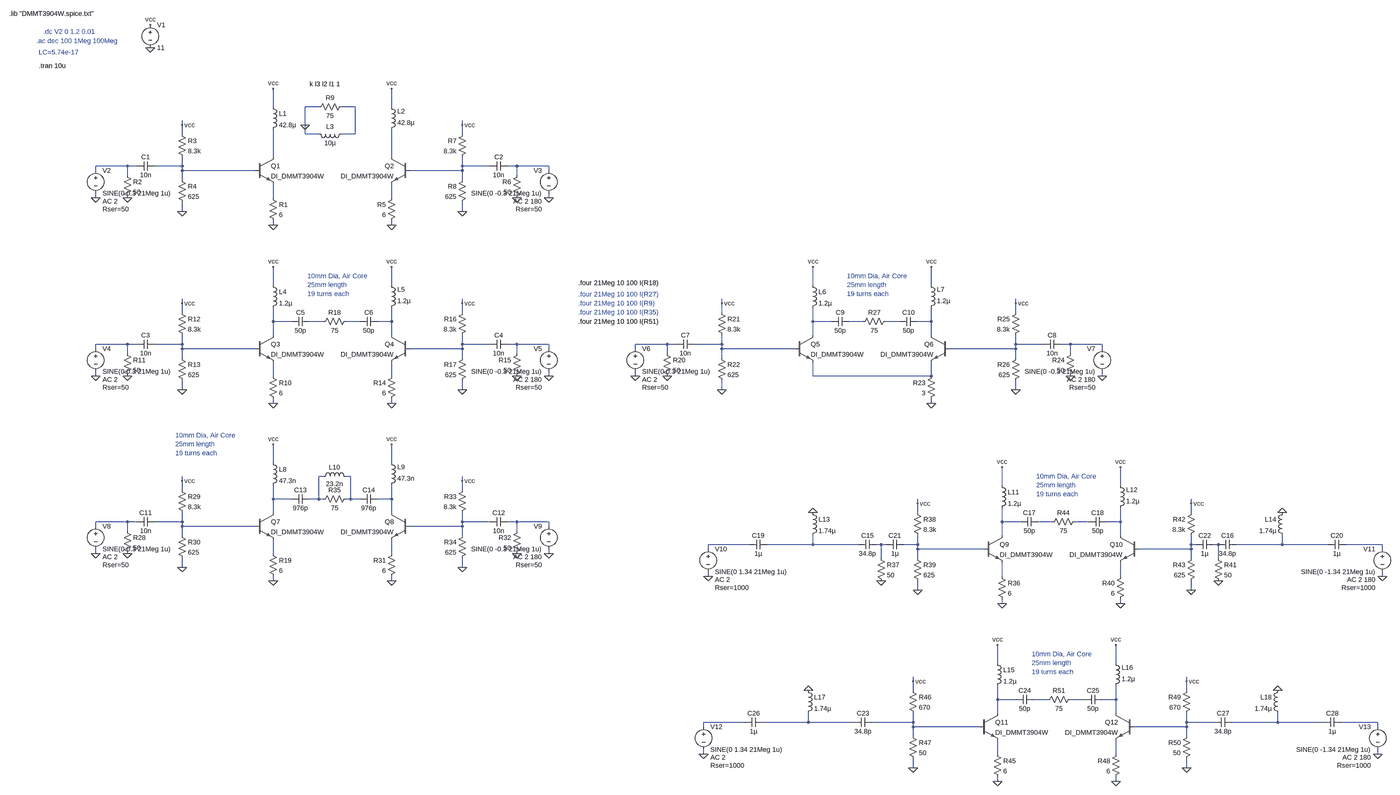
[diagram p0: schematic Class_AB.asc, whole sheet]
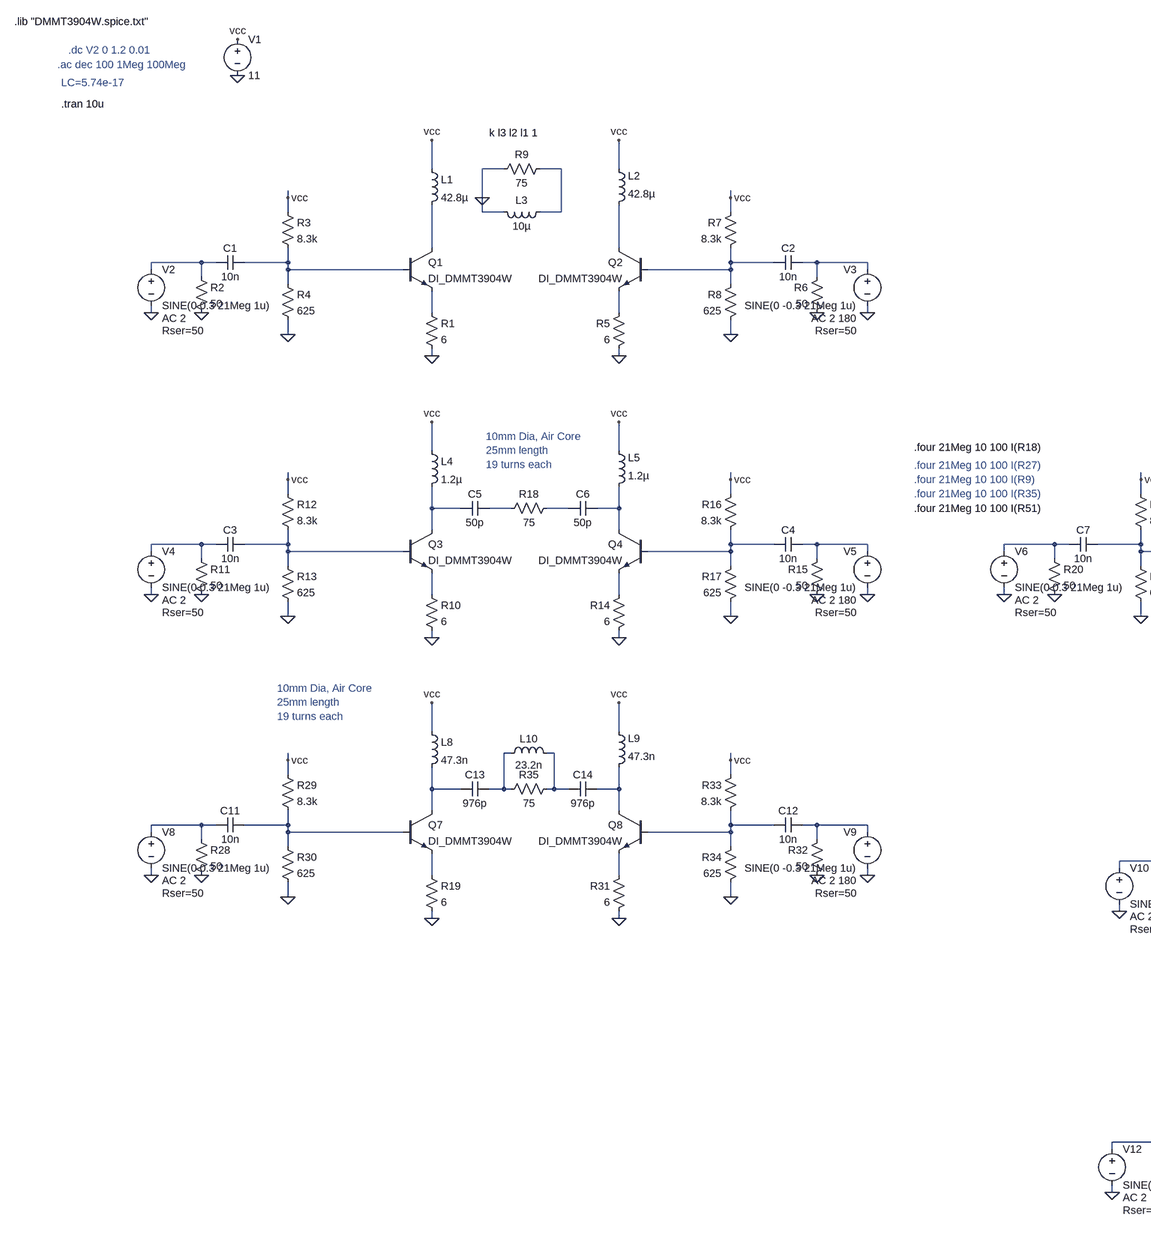
[diagram p1: schematic Class_AB.asc, part, row 1 of 1, column 1 of 2]
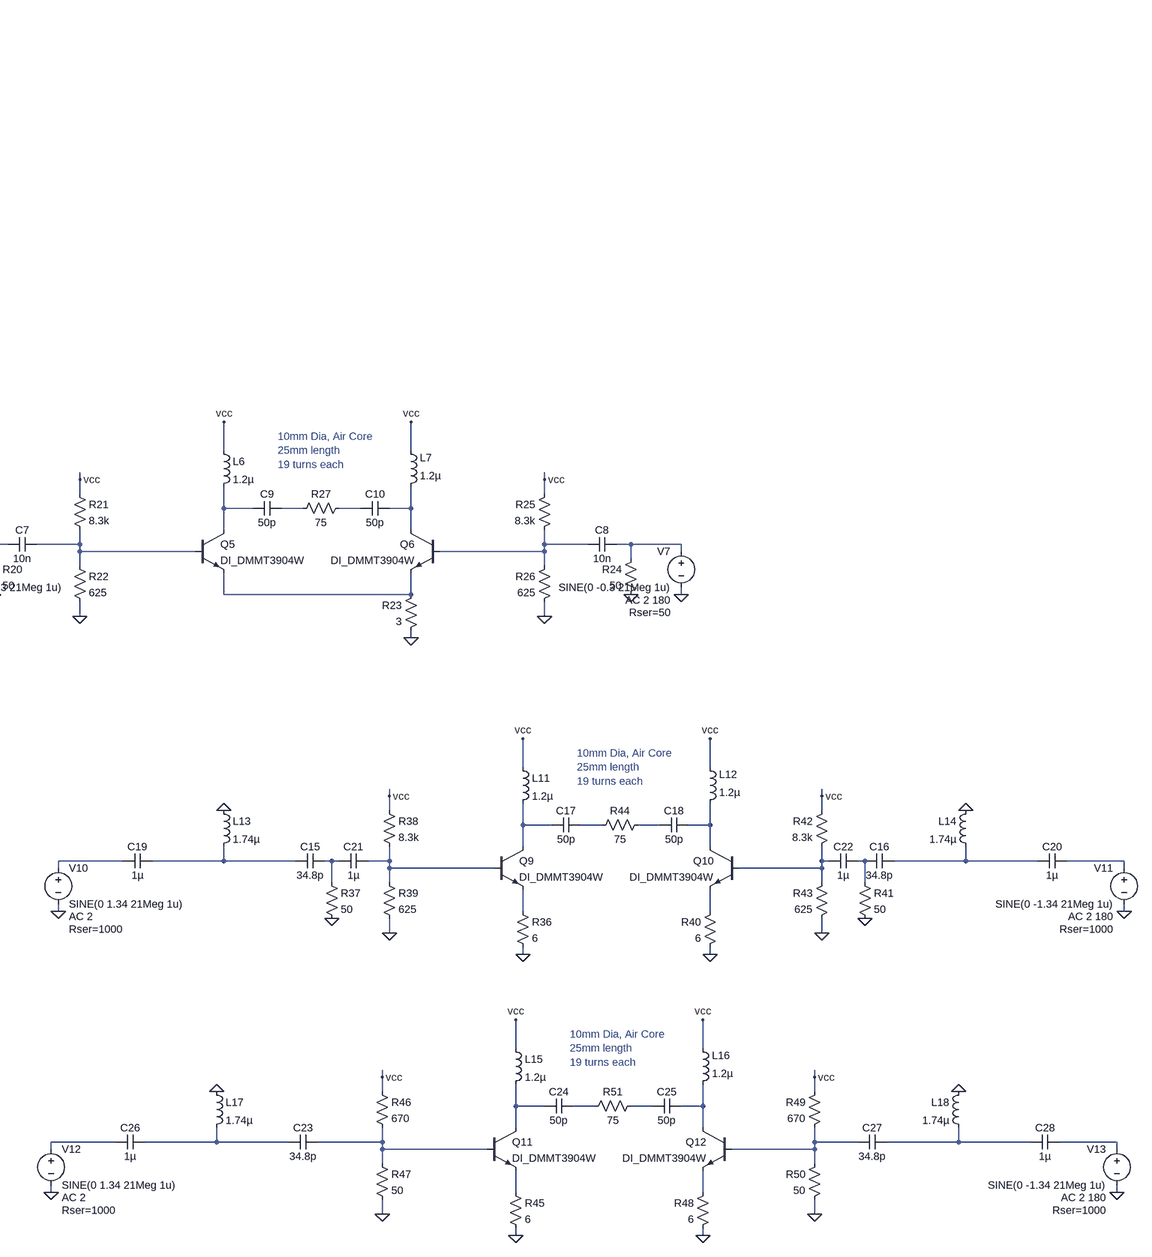
[diagram p2: schematic Class_AB.asc, part, row 1 of 1, column 2 of 2]
Class_AB.asc, the LTspice schematic file:
Version 4.1
SHEET 1 4292 2340
WIRE 192 -80 192 -144
WIRE 352 -80 304 -80
WIRE 480 -80 432 -80
WIRE 608 -80 608 -144
WIRE -128 -16 -128 -32
WIRE 304 -16 304 -80
WIRE 928 -16 928 -32
WIRE -128 16 -128 -16
WIRE 304 16 304 -16
WIRE 352 16 304 16
WIRE 480 16 480 -80
WIRE 480 16 432 16
WIRE 928 16 928 -16
WIRE 192 96 192 0
WIRE 608 96 608 0
WIRE -320 128 -432 128
WIRE -288 128 -320 128
WIRE -128 128 -128 96
WIRE -128 128 -224 128
WIRE 928 128 928 96
WIRE 1024 128 928 128
WIRE 1120 128 1088 128
WIRE 1232 128 1120 128
WIRE -432 144 -432 128
WIRE -128 144 -128 128
WIRE 128 144 -128 144
WIRE 928 144 928 128
WIRE 928 144 672 144
WIRE 1232 144 1232 128
WIRE -320 160 -320 128
WIRE 1120 160 1120 128
WIRE -128 176 -128 144
WIRE 928 176 928 144
WIRE -432 240 -432 224
WIRE 192 240 192 192
WIRE 608 240 608 192
WIRE 1232 240 1232 224
WIRE -128 288 -128 256
WIRE 928 288 928 256
WIRE 192 336 192 320
WIRE 608 336 608 320
WIRE 192 560 192 496
WIRE 608 560 608 496
WIRE 2160 560 2160 496
WIRE 2576 560 2576 496
WIRE -128 624 -128 608
WIRE 928 624 928 608
WIRE 1840 624 1840 608
WIRE 2896 624 2896 608
WIRE -128 656 -128 624
WIRE 928 656 928 624
WIRE 1840 656 1840 624
WIRE 2896 656 2896 624
WIRE 192 688 192 640
WIRE 256 688 192 688
WIRE 368 688 320 688
WIRE 496 688 448 688
WIRE 608 688 608 640
WIRE 608 688 560 688
WIRE 2160 688 2160 640
WIRE 2224 688 2160 688
WIRE 2336 688 2288 688
WIRE 2464 688 2416 688
WIRE 2576 688 2576 640
WIRE 2576 688 2528 688
WIRE 192 736 192 688
WIRE 608 736 608 688
WIRE 2160 736 2160 688
WIRE 2576 736 2576 688
WIRE -320 768 -432 768
WIRE -288 768 -320 768
WIRE -128 768 -128 736
WIRE -128 768 -224 768
WIRE 928 768 928 736
WIRE 1024 768 928 768
WIRE 1120 768 1088 768
WIRE 1232 768 1120 768
WIRE 1648 768 1536 768
WIRE 1680 768 1648 768
WIRE 1840 768 1840 736
WIRE 1840 768 1744 768
WIRE 2896 768 2896 736
WIRE 2992 768 2896 768
WIRE 3088 768 3056 768
WIRE 3200 768 3088 768
WIRE -432 784 -432 768
WIRE -128 784 -128 768
WIRE 128 784 -128 784
WIRE 928 784 928 768
WIRE 928 784 672 784
WIRE 1232 784 1232 768
WIRE 1536 784 1536 768
WIRE 1840 784 1840 768
WIRE 2096 784 1840 784
WIRE 2896 784 2896 768
WIRE 2896 784 2640 784
WIRE 3200 784 3200 768
WIRE -320 800 -320 768
WIRE 1120 800 1120 768
WIRE 1648 800 1648 768
WIRE 3088 800 3088 768
WIRE -128 816 -128 784
WIRE 928 816 928 784
WIRE 1840 816 1840 784
WIRE 2896 816 2896 784
WIRE -432 880 -432 864
WIRE 192 880 192 832
WIRE 608 880 608 832
WIRE 1232 880 1232 864
WIRE 1536 880 1536 864
WIRE 2160 880 2160 832
WIRE 2576 880 2576 832
WIRE 2576 880 2160 880
WIRE 3200 880 3200 864
WIRE -128 928 -128 896
WIRE 928 928 928 896
WIRE 1840 928 1840 896
WIRE 2896 928 2896 896
WIRE 192 976 192 960
WIRE 608 976 608 960
WIRE 2576 976 2576 960
WIRE 192 1184 192 1120
WIRE 608 1184 608 1120
WIRE 368 1232 352 1232
WIRE 464 1232 448 1232
WIRE -128 1248 -128 1232
WIRE 928 1248 928 1232
WIRE 2848 1264 2848 1200
WIRE 3264 1264 3264 1200
WIRE -128 1280 -128 1248
WIRE 928 1280 928 1248
WIRE 192 1312 192 1264
WIRE 256 1312 192 1312
WIRE 352 1312 352 1232
WIRE 352 1312 320 1312
WIRE 368 1312 352 1312
WIRE 464 1312 464 1232
WIRE 464 1312 448 1312
WIRE 496 1312 464 1312
WIRE 608 1312 608 1264
WIRE 608 1312 560 1312
WIRE 2528 1328 2528 1312
WIRE 3584 1328 3584 1312
WIRE 192 1360 192 1312
WIRE 608 1360 608 1312
WIRE 2528 1360 2528 1328
WIRE 3584 1360 3584 1328
WIRE -320 1392 -432 1392
WIRE -288 1392 -320 1392
WIRE -128 1392 -128 1360
WIRE -128 1392 -224 1392
WIRE 928 1392 928 1360
WIRE 1024 1392 928 1392
WIRE 1120 1392 1088 1392
WIRE 1232 1392 1120 1392
WIRE 2848 1392 2848 1344
WIRE 2912 1392 2848 1392
WIRE 3024 1392 2976 1392
WIRE 3152 1392 3104 1392
WIRE 3264 1392 3264 1344
WIRE 3264 1392 3216 1392
WIRE -432 1408 -432 1392
WIRE -128 1408 -128 1392
WIRE 128 1408 -128 1408
WIRE 928 1408 928 1392
WIRE 928 1408 672 1408
WIRE 1232 1408 1232 1392
WIRE -320 1424 -320 1392
WIRE 1120 1424 1120 1392
WIRE -128 1440 -128 1408
WIRE 928 1440 928 1408
WIRE 2848 1440 2848 1392
WIRE 3264 1440 3264 1392
WIRE 1936 1472 1792 1472
WIRE 2160 1472 2160 1440
WIRE 2160 1472 2000 1472
WIRE 2320 1472 2160 1472
WIRE 2400 1472 2384 1472
WIRE 2416 1472 2400 1472
WIRE 2528 1472 2528 1440
WIRE 2528 1472 2480 1472
WIRE 3584 1472 3584 1440
WIRE 3600 1472 3584 1472
WIRE 3680 1472 3664 1472
WIRE 3904 1472 3904 1440
WIRE 3904 1472 3744 1472
WIRE 4064 1472 3904 1472
WIRE 4256 1472 4128 1472
WIRE 1792 1488 1792 1472
WIRE 2528 1488 2528 1472
WIRE 2784 1488 2528 1488
WIRE 3584 1488 3584 1472
WIRE 3584 1488 3328 1488
WIRE 4256 1488 4256 1472
WIRE -432 1504 -432 1488
WIRE 192 1504 192 1456
WIRE 608 1504 608 1456
WIRE 1232 1504 1232 1488
WIRE 2400 1520 2400 1472
WIRE 2528 1520 2528 1488
WIRE 3584 1520 3584 1488
WIRE 3680 1520 3680 1472
WIRE -128 1552 -128 1520
WIRE 928 1552 928 1520
WIRE 1792 1584 1792 1568
WIRE 2848 1584 2848 1536
WIRE 3264 1584 3264 1536
WIRE 4256 1584 4256 1568
WIRE 192 1600 192 1584
WIRE 608 1600 608 1584
WIRE 2528 1632 2528 1600
WIRE 3584 1632 3584 1600
WIRE 2848 1680 2848 1664
WIRE 3264 1680 3264 1664
WIRE 2832 1904 2832 1840
WIRE 3248 1904 3248 1840
WIRE 2512 1968 2512 1952
WIRE 3568 1968 3568 1952
WIRE 2512 2000 2512 1968
WIRE 3568 2000 3568 1968
WIRE 2832 2032 2832 1984
WIRE 2896 2032 2832 2032
WIRE 3008 2032 2960 2032
WIRE 3136 2032 3088 2032
WIRE 3248 2032 3248 1984
WIRE 3248 2032 3200 2032
WIRE 2832 2080 2832 2032
WIRE 3248 2080 3248 2032
WIRE 1920 2112 1776 2112
WIRE 2144 2112 2144 2080
WIRE 2144 2112 1984 2112
WIRE 2304 2112 2144 2112
WIRE 2512 2112 2512 2080
WIRE 2512 2112 2368 2112
WIRE 3568 2112 3568 2080
WIRE 3664 2112 3568 2112
WIRE 3888 2112 3888 2080
WIRE 3888 2112 3728 2112
WIRE 4048 2112 3888 2112
WIRE 4240 2112 4112 2112
WIRE 1776 2128 1776 2112
WIRE 2512 2128 2512 2112
WIRE 2768 2128 2512 2128
WIRE 3568 2128 3568 2112
WIRE 3568 2128 3312 2128
WIRE 4240 2128 4240 2112
WIRE 2512 2160 2512 2128
WIRE 3568 2160 3568 2128
WIRE 1776 2224 1776 2208
WIRE 2832 2224 2832 2176
WIRE 3248 2224 3248 2176
WIRE 4240 2224 4240 2208
WIRE 2512 2272 2512 2240
WIRE 3568 2272 3568 2240
WIRE 2832 2320 2832 2304
WIRE 3248 2320 3248 2304
FLAG -240 -288 0
FLAG -432 240 0
FLAG 192 336 0
FLAG -240 -368 vcc
FLAG -320 240 0
FLAG -128 288 0
FLAG -128 -16 vcc
FLAG 192 -144 vcc
FLAG 1232 240 0
FLAG 608 336 0
FLAG 1120 240 0
FLAG 928 288 0
FLAG 928 -16 vcc
FLAG 608 -144 vcc
FLAG 304 -16 0
FLAG -432 880 0
FLAG 192 976 0
FLAG -320 880 0
FLAG -128 928 0
FLAG -128 624 vcc
FLAG 192 496 vcc
FLAG 1232 880 0
FLAG 608 976 0
FLAG 1120 880 0
FLAG 928 928 0
FLAG 928 624 vcc
FLAG 608 496 vcc
FLAG 1536 880 0
FLAG 1648 880 0
FLAG 1840 928 0
FLAG 1840 624 vcc
FLAG 2160 496 vcc
FLAG 3200 880 0
FLAG 2576 976 0
FLAG 3088 880 0
FLAG 2896 928 0
FLAG 2896 624 vcc
FLAG 2576 496 vcc
FLAG -432 1504 0
FLAG 192 1600 0
FLAG -320 1504 0
FLAG -128 1552 0
FLAG -128 1248 vcc
FLAG 192 1120 vcc
FLAG 1232 1504 0
FLAG 608 1600 0
FLAG 1120 1504 0
FLAG 928 1552 0
FLAG 928 1248 vcc
FLAG 608 1120 vcc
FLAG 1792 1584 0
FLAG 2848 1680 0
FLAG 2528 1632 0
FLAG 2528 1328 vcc
FLAG 2848 1200 vcc
FLAG 4256 1584 0
FLAG 3264 1680 0
FLAG 3584 1632 0
FLAG 3584 1328 vcc
FLAG 3264 1200 vcc
FLAG 2160 1360 0
FLAG 3904 1360 0
FLAG 3680 1600 0
FLAG 2400 1600 0
FLAG 1776 2224 0
FLAG 2832 2320 0
FLAG 2512 2272 0
FLAG 2512 1968 vcc
FLAG 2832 1840 vcc
FLAG 4240 2224 0
FLAG 3248 2320 0
FLAG 3568 2272 0
FLAG 3568 1968 vcc
FLAG 3248 1840 vcc
FLAG 2144 2000 0
FLAG 3888 2000 0
SYMBOL npn 128 96 R0
SYMATTR InstName Q1
SYMATTR Value DI_DMMT3904W
SYMBOL voltage -240 -384 R0
WINDOW 123 0 0 Left 0
WINDOW 39 0 0 Left 0
SYMATTR InstName V1
SYMATTR Value 11
SYMBOL voltage -432 128 R0
WINDOW 123 24 124 Left 2
WINDOW 39 24 152 Left 2
SYMATTR Value2 AC 2
SYMATTR SpiceLine Rser=50
SYMATTR InstName V2
SYMATTR Value SINE(0 0.3 21Meg 1u)
SYMBOL res 176 224 R0
SYMATTR InstName R1
SYMATTR Value 6
SYMBOL cap -224 112 R90
WINDOW 0 0 32 VBottom 2
WINDOW 3 32 32 VTop 2
SYMATTR InstName C1
SYMATTR Value 10n
SYMBOL res -336 144 R0
SYMATTR InstName R2
SYMATTR Value 50
SYMBOL res -144 0 R0
SYMATTR InstName R3
SYMATTR Value 8.3k
SYMBOL res -144 160 R0
SYMATTR InstName R4
SYMATTR Value 625
SYMBOL ind 176 -96 R0
SYMATTR InstName L1
SYMATTR Value 42.8µ
SYMATTR Type ind
SYMATTR SpiceLine Rser=1m
SYMBOL npn 672 96 M0
SYMATTR InstName Q2
SYMATTR Value DI_DMMT3904W
SYMBOL voltage 1232 128 M0
WINDOW 123 24 124 Left 2
WINDOW 39 24 152 Left 2
SYMATTR Value2 AC 2 180
SYMATTR SpiceLine Rser=50
SYMATTR InstName V3
SYMATTR Value SINE(0 -0.3 21Meg 1u)
SYMBOL res 624 224 M0
SYMATTR InstName R5
SYMATTR Value 6
SYMBOL cap 1024 112 M90
WINDOW 0 0 32 VBottom 2
WINDOW 3 32 32 VTop 2
SYMATTR InstName C2
SYMATTR Value 10n
SYMBOL res 1136 144 M0
SYMATTR InstName R6
SYMATTR Value 50
SYMBOL res 944 0 M0
SYMATTR InstName R7
SYMATTR Value 8.3k
SYMBOL res 944 160 M0
SYMATTR InstName R8
SYMATTR Value 625
SYMBOL ind 592 16 M180
WINDOW 0 36 80 Left 2
WINDOW 3 36 40 Left 2
SYMATTR InstName L2
SYMATTR Value 42.8µ
SYMATTR Type ind
SYMATTR SpiceLine Rser=1m
SYMBOL ind 448 0 R90
WINDOW 0 5 56 VBottom 2
WINDOW 3 32 56 VTop 2
SYMATTR InstName L3
SYMATTR Value 10µ
SYMATTR Type ind
SYMATTR SpiceLine Rser=1m
SYMBOL res 448 -96 R90
WINDOW 0 0 56 VBottom 2
WINDOW 3 32 56 VTop 2
SYMATTR InstName R9
SYMATTR Value 75
SYMBOL npn 128 736 R0
SYMATTR InstName Q3
SYMATTR Value DI_DMMT3904W
SYMBOL voltage -432 768 R0
WINDOW 123 24 124 Left 2
WINDOW 39 24 152 Left 2
SYMATTR Value2 AC 2
SYMATTR SpiceLine Rser=50
SYMATTR InstName V4
SYMATTR Value SINE(0 0.3 21Meg 1u)
SYMBOL res 176 864 R0
SYMATTR InstName R10
SYMATTR Value 6
SYMBOL cap -224 752 R90
WINDOW 0 0 32 VBottom 2
WINDOW 3 32 32 VTop 2
SYMATTR InstName C3
SYMATTR Value 10n
SYMBOL res -336 784 R0
SYMATTR InstName R11
SYMATTR Value 50
SYMBOL res -144 640 R0
SYMATTR InstName R12
SYMATTR Value 8.3k
SYMBOL res -144 800 R0
SYMATTR InstName R13
SYMATTR Value 625
SYMBOL ind 176 544 R0
SYMATTR InstName L4
SYMATTR Value 1.2µ
SYMATTR SpiceLine Rser=1m
SYMBOL npn 672 736 M0
SYMATTR InstName Q4
SYMATTR Value DI_DMMT3904W
SYMBOL voltage 1232 768 M0
WINDOW 123 24 124 Left 2
WINDOW 39 24 152 Left 2
SYMATTR Value2 AC 2 180
SYMATTR SpiceLine Rser=50
SYMATTR InstName V5
SYMATTR Value SINE(0 -0.3 21Meg 1u)
SYMBOL res 624 864 M0
SYMATTR InstName R14
SYMATTR Value 6
SYMBOL cap 1024 752 M90
WINDOW 0 0 32 VBottom 2
WINDOW 3 32 32 VTop 2
SYMATTR InstName C4
SYMATTR Value 10n
SYMBOL res 1136 784 M0
SYMATTR InstName R15
SYMATTR Value 50
SYMBOL res 944 640 M0
SYMATTR InstName R16
SYMATTR Value 8.3k
SYMBOL res 944 800 M0
SYMATTR InstName R17
SYMATTR Value 625
SYMBOL ind 592 656 M180
WINDOW 0 36 80 Left 2
WINDOW 3 36 40 Left 2
SYMATTR InstName L5
SYMATTR Value 1.2µ
SYMATTR SpiceLine Rser=1m
SYMBOL res 464 672 R90
WINDOW 0 0 56 VBottom 2
WINDOW 3 32 56 VTop 2
SYMATTR InstName R18
SYMATTR Value 75
SYMBOL cap 320 672 R90
WINDOW 0 0 32 VBottom 2
WINDOW 3 32 32 VTop 2
SYMATTR InstName C5
SYMATTR Value 50p
SYMBOL cap 560 672 R90
WINDOW 0 0 32 VBottom 2
WINDOW 3 32 32 VTop 2
SYMATTR InstName C6
SYMATTR Value 50p
SYMBOL npn 2096 736 R0
SYMATTR InstName Q5
SYMATTR Value DI_DMMT3904W
SYMBOL voltage 1536 768 R0
WINDOW 123 24 124 Left 2
WINDOW 39 24 152 Left 2
SYMATTR Value2 AC 2
SYMATTR SpiceLine Rser=50
SYMATTR InstName V6
SYMATTR Value SINE(0 0.3 21Meg 1u)
SYMBOL cap 1744 752 R90
WINDOW 0 0 32 VBottom 2
WINDOW 3 32 32 VTop 2
SYMATTR InstName C7
SYMATTR Value 10n
SYMBOL res 1632 784 R0
SYMATTR InstName R20
SYMATTR Value 50
SYMBOL res 1824 640 R0
SYMATTR InstName R21
SYMATTR Value 8.3k
SYMBOL res 1824 800 R0
SYMATTR InstName R22
SYMATTR Value 625
SYMBOL ind 2144 544 R0
SYMATTR InstName L6
SYMATTR Value 1.2µ
SYMATTR SpiceLine Rser=1m
SYMBOL npn 2640 736 M0
SYMATTR InstName Q6
SYMATTR Value DI_DMMT3904W
SYMBOL voltage 3200 768 M0
WINDOW 123 24 124 Left 2
WINDOW 39 24 152 Left 2
SYMATTR Value2 AC 2 180
SYMATTR SpiceLine Rser=50
SYMATTR InstName V7
SYMATTR Value SINE(0 -0.3 21Meg 1u)
SYMBOL res 2592 864 M0
SYMATTR InstName R23
SYMATTR Value 3
SYMBOL cap 2992 752 M90
WINDOW 0 0 32 VBottom 2
WINDOW 3 32 32 VTop 2
SYMATTR InstName C8
SYMATTR Value 10n
SYMBOL res 3104 784 M0
SYMATTR InstName R24
SYMATTR Value 50
SYMBOL res 2912 640 M0
SYMATTR InstName R25
SYMATTR Value 8.3k
SYMBOL res 2912 800 M0
SYMATTR InstName R26
SYMATTR Value 625
SYMBOL ind 2560 656 M180
WINDOW 0 36 80 Left 2
WINDOW 3 36 40 Left 2
SYMATTR InstName L7
SYMATTR Value 1.2µ
SYMATTR SpiceLine Rser=1m
SYMBOL res 2432 672 R90
WINDOW 0 0 56 VBottom 2
WINDOW 3 32 56 VTop 2
SYMATTR InstName R27
SYMATTR Value 75
SYMBOL cap 2288 672 R90
WINDOW 0 0 32 VBottom 2
WINDOW 3 32 32 VTop 2
SYMATTR InstName C9
SYMATTR Value 50p
SYMBOL cap 2528 672 R90
WINDOW 0 0 32 VBottom 2
WINDOW 3 32 32 VTop 2
SYMATTR InstName C10
SYMATTR Value 50p
SYMBOL npn 128 1360 R0
SYMATTR InstName Q7
SYMATTR Value DI_DMMT3904W
SYMBOL voltage -432 1392 R0
WINDOW 123 24 124 Left 2
WINDOW 39 24 152 Left 2
SYMATTR Value2 AC 2
SYMATTR SpiceLine Rser=50
SYMATTR InstName V8
SYMATTR Value SINE(0 0.3 21Meg 1u)
SYMBOL res 176 1488 R0
SYMATTR InstName R19
SYMATTR Value 6
SYMBOL cap -224 1376 R90
WINDOW 0 0 32 VBottom 2
WINDOW 3 32 32 VTop 2
SYMATTR InstName C11
SYMATTR Value 10n
SYMBOL res -336 1408 R0
SYMATTR InstName R28
SYMATTR Value 50
SYMBOL res -144 1264 R0
SYMATTR InstName R29
SYMATTR Value 8.3k
SYMBOL res -144 1424 R0
SYMATTR InstName R30
SYMATTR Value 625
SYMBOL ind 176 1168 R0
SYMATTR InstName L8
SYMATTR Value 47.3n
SYMATTR SpiceLine Rser=1m
SYMBOL npn 672 1360 M0
SYMATTR InstName Q8
SYMATTR Value DI_DMMT3904W
SYMBOL voltage 1232 1392 M0
WINDOW 123 24 124 Left 2
WINDOW 39 24 152 Left 2
SYMATTR Value2 AC 2 180
SYMATTR SpiceLine Rser=50
SYMATTR InstName V9
SYMATTR Value SINE(0 -0.3 21Meg 1u)
SYMBOL res 624 1488 M0
SYMATTR InstName R31
SYMATTR Value 6
SYMBOL cap 1024 1376 M90
WINDOW 0 0 32 VBottom 2
WINDOW 3 32 32 VTop 2
SYMATTR InstName C12
SYMATTR Value 10n
SYMBOL res 1136 1408 M0
SYMATTR InstName R32
SYMATTR Value 50
SYMBOL res 944 1264 M0
SYMATTR InstName R33
SYMATTR Value 8.3k
SYMBOL res 944 1424 M0
SYMATTR InstName R34
SYMATTR Value 625
SYMBOL ind 592 1280 M180
WINDOW 0 36 80 Left 2
WINDOW 3 36 40 Left 2
SYMATTR InstName L9
SYMATTR Value 47.3n
SYMATTR SpiceLine Rser=1m
SYMBOL res 464 1296 R90
WINDOW 0 0 56 VBottom 2
WINDOW 3 32 56 VTop 2
SYMATTR InstName R35
SYMATTR Value 75
SYMBOL cap 320 1296 R90
WINDOW 0 0 32 VBottom 2
WINDOW 3 32 32 VTop 2
SYMATTR InstName C13
SYMATTR Value 976p
SYMBOL cap 560 1296 R90
WINDOW 0 0 32 VBottom 2
WINDOW 3 32 32 VTop 2
SYMATTR InstName C14
SYMATTR Value 976p
SYMBOL ind 352 1248 R270
WINDOW 0 32 56 VTop 2
WINDOW 3 5 56 VBottom 2
SYMATTR InstName L10
SYMATTR Value 23.2n
SYMATTR SpiceLine Rser=1m
SYMBOL npn 2784 1440 R0
SYMATTR InstName Q9
SYMATTR Value DI_DMMT3904W
SYMBOL voltage 1792 1472 R0
WINDOW 123 24 124 Left 2
WINDOW 39 24 152 Left 2
SYMATTR Value2 AC 2
SYMATTR SpiceLine Rser=1000
SYMATTR InstName V10
SYMATTR Value SINE(0 1.34 21Meg 1u)
SYMBOL res 2832 1568 R0
SYMATTR InstName R36
SYMATTR Value 6
SYMBOL cap 2384 1456 R90
WINDOW 0 0 32 VBottom 2
WINDOW 3 32 32 VTop 2
SYMATTR InstName C15
SYMATTR Value 34.8p
SYMBOL res 2512 1344 R0
SYMATTR InstName R38
SYMATTR Value 8.3k
SYMBOL res 2512 1504 R0
SYMATTR InstName R39
SYMATTR Value 625
SYMBOL ind 2832 1248 R0
SYMATTR InstName L11
SYMATTR Value 1.2µ
SYMATTR SpiceLine Rser=1m
SYMBOL npn 3328 1440 M0
SYMATTR InstName Q10
SYMATTR Value DI_DMMT3904W
SYMBOL voltage 4256 1472 M0
WINDOW 123 24 124 Left 2
WINDOW 39 24 152 Left 2
SYMATTR Value2 AC 2 180
SYMATTR SpiceLine Rser=1000
SYMATTR InstName V11
SYMATTR Value SINE(0 -1.34 21Meg 1u)
SYMBOL res 3280 1568 M0
SYMATTR InstName R40
SYMATTR Value 6
SYMBOL res 3600 1344 M0
SYMATTR InstName R42
SYMATTR Value 8.3k
SYMBOL res 3600 1504 M0
SYMATTR InstName R43
SYMATTR Value 625
SYMBOL ind 3248 1360 M180
WINDOW 0 36 80 Left 2
WINDOW 3 36 40 Left 2
SYMATTR InstName L12
SYMATTR Value 1.2µ
SYMATTR SpiceLine Rser=1m
SYMBOL res 3120 1376 R90
WINDOW 0 0 56 VBottom 2
WINDOW 3 32 56 VTop 2
SYMATTR InstName R44
SYMATTR Value 75
SYMBOL cap 2976 1376 R90
WINDOW 0 0 32 VBottom 2
WINDOW 3 32 32 VTop 2
SYMATTR InstName C17
SYMATTR Value 50p
SYMBOL cap 3216 1376 R90
WINDOW 0 0 32 VBottom 2
WINDOW 3 32 32 VTop 2
SYMATTR InstName C18
SYMATTR Value 50p
SYMBOL ind 2144 1344 R0
SYMATTR InstName L13
SYMATTR Value 1.74µ
SYMATTR SpiceLine Rser=1m
SYMBOL cap 2000 1456 R90
WINDOW 0 0 32 VBottom 2
WINDOW 3 32 32 VTop 2
SYMATTR InstName C19
SYMATTR Value 1µ
SYMBOL cap 3680 1456 M90
WINDOW 0 0 32 VBottom 2
WINDOW 3 32 32 VTop 2
SYMATTR InstName C16
SYMATTR Value 34.8p
SYMBOL ind 3920 1344 M0
SYMATTR InstName L14
SYMATTR Value 1.74µ
SYMATTR SpiceLine Rser=1m
SYMBOL cap 4064 1456 M90
WINDOW 0 0 32 VBottom 2
WINDOW 3 32 32 VTop 2
SYMATTR InstName C20
SYMATTR Value 1µ
SYMBOL cap 2480 1456 R90
WINDOW 0 0 32 VBottom 2
WINDOW 3 32 32 VTop 2
SYMATTR InstName C21
SYMATTR Value 1µ
SYMBOL cap 3664 1456 R90
WINDOW 0 0 32 VBottom 2
WINDOW 3 32 32 VTop 2
SYMATTR InstName C22
SYMATTR Value 1µ
SYMBOL res 2384 1504 R0
SYMATTR InstName R37
SYMATTR Value 50
SYMBOL res 3664 1504 R0
SYMATTR InstName R41
SYMATTR Value 50
SYMBOL npn 2768 2080 R0
SYMATTR InstName Q11
SYMATTR Value DI_DMMT3904W
SYMBOL voltage 1776 2112 R0
WINDOW 123 24 124 Left 2
WINDOW 39 24 152 Left 2
SYMATTR Value2 AC 2
SYMATTR SpiceLine Rser=1000
SYMATTR InstName V12
SYMATTR Value SINE(0 1.34 21Meg 1u)
SYMBOL res 2816 2208 R0
SYMATTR InstName R45
SYMATTR Value 6
SYMBOL cap 2368 2096 R90
WINDOW 0 0 32 VBottom 2
WINDOW 3 32 32 VTop 2
SYMATTR InstName C23
SYMATTR Value 34.8p
SYMBOL res 2496 1984 R0
SYMATTR InstName R46
SYMATTR Value 670
SYMBOL res 2496 2144 R0
SYMATTR InstName R47
SYMATTR Value 50
SYMBOL ind 2816 1888 R0
SYMATTR InstName L15
SYMATTR Value 1.2µ
SYMATTR SpiceLine Rser=1m
SYMBOL npn 3312 2080 M0
SYMATTR InstName Q12
SYMATTR Value DI_DMMT3904W
SYMBOL voltage 4240 2112 M0
WINDOW 123 24 124 Left 2
WINDOW 39 24 152 Left 2
SYMATTR Value2 AC 2 180
SYMATTR SpiceLine Rser=1000
SYMATTR InstName V13
SYMATTR Value SINE(0 -1.34 21Meg 1u)
SYMBOL res 3264 2208 M0
SYMATTR InstName R48
SYMATTR Value 6
SYMBOL res 3584 1984 M0
SYMATTR InstName R49
SYMATTR Value 670
SYMBOL res 3584 2144 M0
SYMATTR InstName R50
SYMATTR Value 50
SYMBOL ind 3232 2000 M180
WINDOW 0 36 80 Left 2
WINDOW 3 36 40 Left 2
SYMATTR InstName L16
SYMATTR Value 1.2µ
SYMATTR SpiceLine Rser=1m
SYMBOL res 3104 2016 R90
WINDOW 0 0 56 VBottom 2
WINDOW 3 32 56 VTop 2
SYMATTR InstName R51
SYMATTR Value 75
SYMBOL cap 2960 2016 R90
WINDOW 0 0 32 VBottom 2
WINDOW 3 32 32 VTop 2
SYMATTR InstName C24
SYMATTR Value 50p
SYMBOL cap 3200 2016 R90
WINDOW 0 0 32 VBottom 2
WINDOW 3 32 32 VTop 2
SYMATTR InstName C25
SYMATTR Value 50p
SYMBOL ind 2128 1984 R0
SYMATTR InstName L17
SYMATTR Value 1.74µ
SYMATTR SpiceLine Rser=1m
SYMBOL cap 1984 2096 R90
WINDOW 0 0 32 VBottom 2
WINDOW 3 32 32 VTop 2
SYMATTR InstName C26
SYMATTR Value 1µ
SYMBOL cap 3664 2096 M90
WINDOW 0 0 32 VBottom 2
WINDOW 3 32 32 VTop 2
SYMATTR InstName C27
SYMATTR Value 34.8p
SYMBOL ind 3904 1984 M0
SYMATTR InstName L18
SYMATTR Value 1.74µ
SYMATTR SpiceLine Rser=1m
SYMBOL cap 4048 2096 M90
WINDOW 0 0 32 VBottom 2
WINDOW 3 32 32 VTop 2
SYMATTR InstName C28
SYMATTR Value 1µ
TEXT -736 -408 Left 2 !.lib "DMMT3904W.spice.txt"
TEXT -616 -344 Left 2 ;.dc V2 0 1.2 0.01
TEXT -640 -312 Left 2 ;.ac dec 100 1Meg 100Meg
TEXT -632 -272 Left 2 ;LC=5.74e-17
TEXT 320 -160 Left 2 !k l3 l2 l1 1
TEXT -632 -224 Left 2 !.tran 10u
TEXT 312 528 Left 2 ;10mm Dia, Air Core\n25mm length\n19 turns each
TEXT 2280 528 Left 2 ;10mm Dia, Air Core\n25mm length\n19 turns each
TEXT 1336 552 Left 2 !.four 21Meg 10 100 I(R18)
TEXT 1336 592 Left 2 ;.four 21Meg 10 100 I(R27)
TEXT 1336 624 Left 2 ;.four 21Meg 10 100 I(R9)
TEXT -152 1088 Left 2 ;10mm Dia, Air Core\n25mm length\n19 turns each
TEXT 1336 656 Left 2 ;.four 21Meg 10 100 I(R35)
TEXT 2968 1232 Left 2 ;10mm Dia, Air Core\n25mm length\n19 turns each
TEXT 2952 1872 Left 2 ;10mm Dia, Air Core\n25mm length\n19 turns each
TEXT 1336 688 Left 2 !.four 21Meg 10 100 I(R51)

The netlist it stands for:
* Class_AB.asc
Q1 N002 N005 N008 0 DI_DMMT3904W
V1 vcc 0 11
V2 N004 0 SINE(0 0.3 21Meg 1u) AC 2 Rser=50
R1 N008 0 6
C1 N005 N004 10n
R2 N004 0 50
R3 vcc N005 8.3k
R4 N005 0 625
L1 vcc N002 42.8µ Rser=1m
Q2 N003 N006 N009 0 DI_DMMT3904W
V3 N007 0 SINE(0 -0.3 21Meg 1u) AC 2 180 Rser=50
R5 N009 0 6
C2 N006 N007 10n
R6 N007 0 50
R7 vcc N006 8.3k
R8 N006 0 625
L2 N003 vcc 42.8µ Rser=1m
L3 N001 0 10µ Rser=1m
R9 N001 0 75
Q3 N010 N019 N026 0 DI_DMMT3904W
V4 N018 0 SINE(0 0.3 21Meg 1u) AC 2 Rser=50
R10 N026 0 6
C3 N019 N018 10n
R11 N018 0 50
R12 vcc N019 8.3k
R13 N019 0 625
L4 vcc N010 1.2µ Rser=1m
Q4 N013 N020 N027 0 DI_DMMT3904W
V5 N021 0 SINE(0 -0.3 21Meg 1u) AC 2 180 Rser=50
R14 N027 0 6
C4 N020 N021 10n
R15 N021 0 50
R16 vcc N020 8.3k
R17 N020 0 625
L5 N013 vcc 1.2µ Rser=1m
R18 N012 N011 75
C5 N011 N010 50p
C6 N013 N012 50p
Q5 N014 N023 N028 0 DI_DMMT3904W
V6 N022 0 SINE(0 0.3 21Meg 1u) AC 2 Rser=50
C7 N023 N022 10n
R20 N022 0 50
R21 vcc N023 8.3k
R22 N023 0 625
L6 vcc N014 1.2µ Rser=1m
Q6 N017 N024 N028 0 DI_DMMT3904W
V7 N025 0 SINE(0 -0.3 21Meg 1u) AC 2 180 Rser=50
R23 N028 0 3
C8 N024 N025 10n
R24 N025 0 50
R25 vcc N024 8.3k
R26 N024 0 625
L7 N017 vcc 1.2µ Rser=1m
R27 N016 N015 75
C9 N015 N014 50p
C10 N017 N016 50p
Q7 N031 N034 N049 0 DI_DMMT3904W
V8 N033 0 SINE(0 0.3 21Meg 1u) AC 2 Rser=50
R19 N049 0 6
C11 N034 N033 10n
R28 N033 0 50
R29 vcc N034 8.3k
R30 N034 0 625
L8 vcc N031 47.3n Rser=1m
Q8 N032 N035 N050 0 DI_DMMT3904W
V9 N036 0 SINE(0 -0.3 21Meg 1u) AC 2 180 Rser=50
R31 N050 0 6
C12 N035 N036 10n
R32 N036 0 50
R33 vcc N035 8.3k
R34 N035 0 625
L9 N032 vcc 47.3n Rser=1m
R35 N030 N029 75
C13 N029 N031 976p
C14 N032 N030 976p
L10 N029 N030 23.2n Rser=1m
Q9 N037 N044 N051 0 DI_DMMT3904W
V10 N041 0 SINE(0 1.34 21Meg 1u) AC 2 Rser=1000
R36 N051 0 6
C15 N043 N042 34.8p
R38 vcc N044 8.3k
R39 N044 0 625
L11 vcc N037 1.2µ Rser=1m
Q10 N040 N045 N052 0 DI_DMMT3904W
V11 N048 0 SINE(0 -1.34 21Meg 1u) AC 2 180 Rser=1000
R40 N052 0 6
R42 vcc N045 8.3k
R43 N045 0 625
L12 N040 vcc 1.2µ Rser=1m
R44 N039 N038 75
C17 N038 N037 50p
C18 N040 N039 50p
L13 0 N042 1.74µ Rser=1m
C19 N042 N041 1µ
C16 N046 N047 34.8p
L14 0 N047 1.74µ Rser=1m
C20 N047 N048 1µ
C21 N044 N043 1µ
C22 N046 N045 1µ
R37 N043 0 50
R41 N046 0 50
Q11 N053 N059 N063 0 DI_DMMT3904W
V12 N057 0 SINE(0 1.34 21Meg 1u) AC 2 Rser=1000
R45 N063 0 6
C23 N059 N058 34.8p
R46 vcc N059 670
R47 N059 0 50
L15 vcc N053 1.2µ Rser=1m
Q12 N056 N060 N064 0 DI_DMMT3904W
V13 N062 0 SINE(0 -1.34 21Meg 1u) AC 2 180 Rser=1000
R48 N064 0 6
R49 vcc N060 670
R50 N060 0 50
L16 N056 vcc 1.2µ Rser=1m
R51 N055 N054 75
C24 N054 N053 50p
C25 N056 N055 50p
L17 0 N058 1.74µ Rser=1m
C26 N058 N057 1µ
C27 N060 N061 34.8p
L18 0 N061 1.74µ Rser=1m
C28 N061 N062 1µ
.model NPN NPN
.model PNP PNP
.lib standard.bjt
.lib "DMMT3904W.spice.txt"
* .dc V2 0 1.2 0.01
* .ac dec 100 1Meg 100Meg
* LC=5.74e-17
k l3 l2 l1 1
.tran 10u
* 10mm Dia, Air Core
* 25mm length
* 19 turns each
* 10mm Dia, Air Core
* 25mm length
* 19 turns each
.four 21Meg 10 100 I(R18)
* .four 21Meg 10 100 I(R27)
* .four 21Meg 10 100 I(R9)
* 10mm Dia, Air Core
* 25mm length
* 19 turns each
* .four 21Meg 10 100 I(R35)
* 10mm Dia, Air Core
* 25mm length
* 19 turns each
* 10mm Dia, Air Core
* 25mm length
* 19 turns each
.four 21Meg 10 100 I(R51)
.backanno
.end